# EAGLE schematic picII (EAGLE 9.6.2)
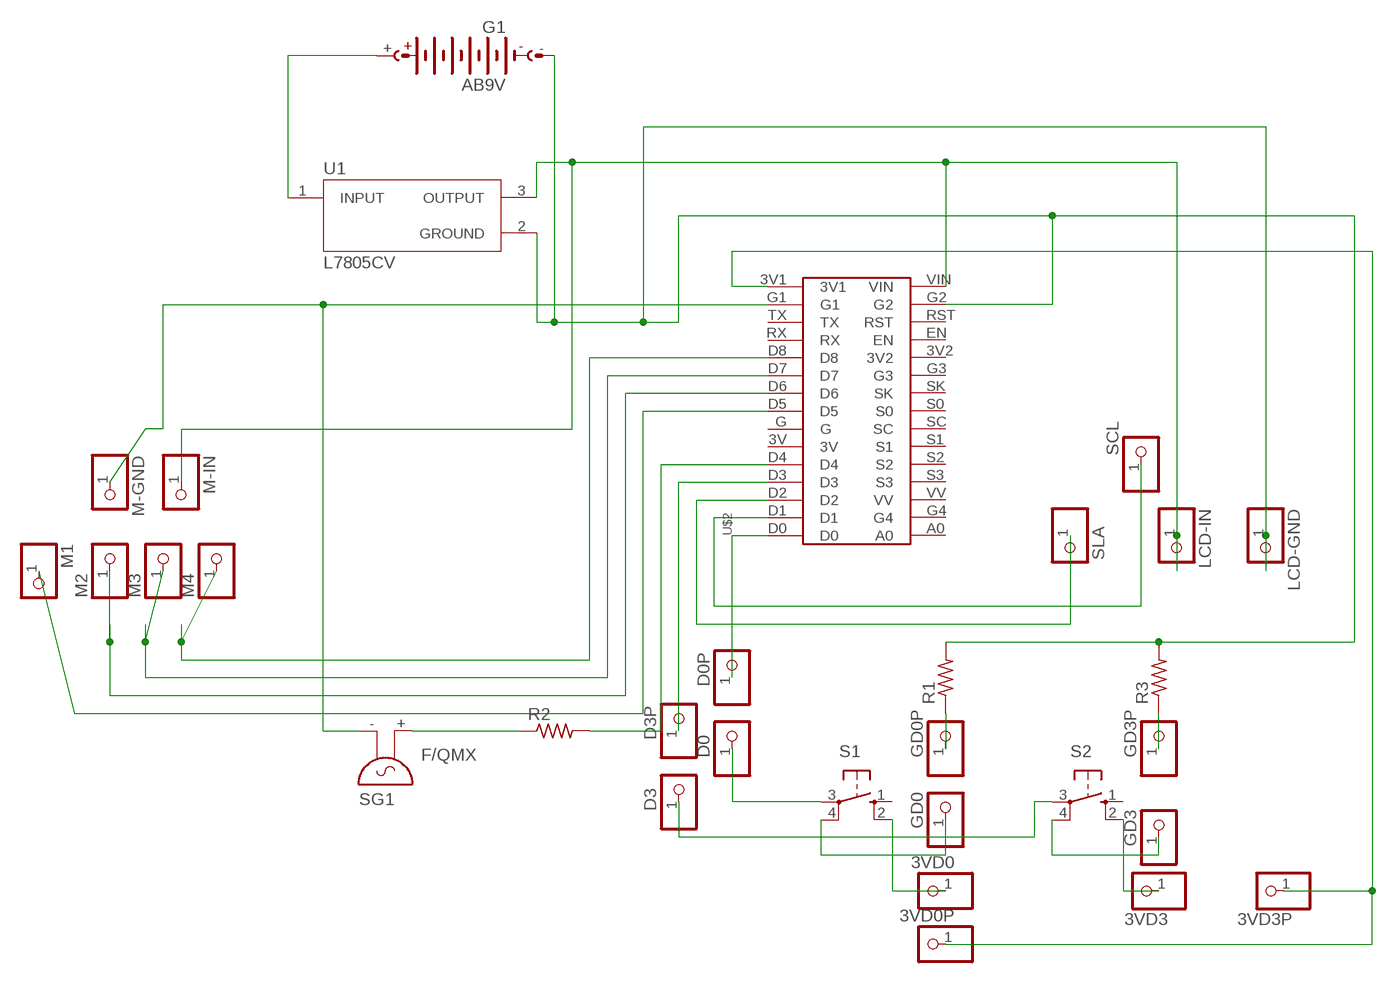
[diagram p0: schematic, sheet 1]

## Parts
3VD0  PINHD-1X1  [1X01]
3VD0P  PINHD-1X1  [1X01]
3VD3  PINHD-1X1  [1X01]
3VD3P  PINHD-1X1  [1X01]
D0  PINHD-1X1  [1X01]
D0P  PINHD-1X1  [1X01]
D3  PINHD-1X1  [1X01]
D3P  PINHD-1X1  [1X01]
G1  AB9V  [AB9V]
GD0  PINHD-1X1  [1X01]
GD0P  PINHD-1X1  [1X01]
GD3  PINHD-1X1  [1X01]
GD3P  PINHD-1X1  [1X01]
LCD-GND  PINHD-1X1  [1X01]
LCD-IN  PINHD-1X1  [1X01]
M1  PINHD-1X1  [1X01]
M2  PINHD-1X1  [1X01]
M3  PINHD-1X1  [1X01]
M4  PINHD-1X1  [1X01]
M-GND  PINHD-1X1  [1X01]
M-IN  PINHD-1X1  [1X01]
R1  R-US_0204/7  [0204/7]
R2  R-US_0204/7  [0204/7]
R3  R-US_0204/7  [0204/7]
S1  40-XX  [B3F-40XX]
S2  40-XX  [B3F-40XX]
SCL  PINHD-1X1  [1X01]
SG1  F/QMX  [F/QMX]
SLA  PINHD-1X1  [1X01]
U1  L7805CV  [TO255P1040X460X1968-3]
U$2  LOLIN  [LOLIN]

## Nets
N$1: G1.+ U1.1(INPUT)
N$2: R2.1 SG1.+
N$3: 3VD0P.1 3VD3P.1 U$2.3V1
N$4: M1.1 U$2.D5
N$5: M2.1 U$2.D6
N$6: R2.2 U$2.D4
N$7: GD0.1 S1.4(P1)
N$8: SLA.1 U$2.D2
N$9: SCL.1 U$2.D1
N$10: M3.1 U$2.D7
N$11: M4.1 U$2.D8
N$12: D0.1 S1.3(P)
N$13: D3.1 S2.3(P)
N$14: M-GND.1 SG1.- U$2.G1
N$15: G1.- LCD-GND.1 R1.2 R3.2 U1.2(GROUND) U$2.G2
N$16: GD3.1 S2.4(P1)
N$17: LCD-IN.1 M-IN.1 U1.3(OUTPUT) U$2.VIN
N$18: GD0P.1 R1.1
N$19: GD3P.1 R3.1
N$20: 3VD0.1 S1.2(S1)
N$21: 3VD3.1 S2.2(S1)
N$22: D0P.1 U$2.D0
N$23: D3P.1 U$2.D3
Unconnected: S1.1(S) S2.1(S) U$2.3V U$2.3V2 U$2.A0 U$2.EN U$2.G U$2.G3 U$2.G4 U$2.RST U$2.RX U$2.S0 U$2.S1 U$2.S2 U$2.S3 U$2.SC U$2.SK U$2.TX U$2.VV

## Library data of the parts
3VD0 3VD0P 3VD3 3VD3P D0 D0P D3 D3P GD0 GD0P GD3 GD3P LCD-GND LCD-IN M1-M4 M-GND M-IN SCL SLA = pinhead:PINHD-1X1: PIN HEADER
G1 = battery:AB9V: 9-V BATTERY CLIP
R1-R3 = rcl:R-US_: RESISTOR, American symbol; SPICEPREFIX: R
S1 S2 = switch-omron:40-XX: OMRON SWITCH; MF: OMRON COMPONENTS USA; MPN: B3F-4000; OC_FARNELL: 176434; OC_NEWARK: 36K3105
SG1 = buzzer:F/QMX: BUZZER Source: Buerklin; OC_FARNELL: unknown; OC_NEWARK: unknown
U1 = L7805CV:L7805CV: Standard Regulator Pos 5V 1.5A 3-Pin(3+Tab) TO-220 Standard Regulator Pos 5V 1.5A 3-Pin(3+Tab) TO-220 Check availability <https://pricing.snapeda.com/parts/L7805CV/STMicroelectronics/view-part?ref=eda>; AVAILABILITY: In Stock; DESCRIPTION: Linear Voltage Regulator IC Positive Fixed 1 Output 1.5A TO-220; MF: STMicroelectronics; MP: L7805CV; PACKAGE: TO-220-3 STMicroelectronics; PRICE: None; PURCHASE-URL: https://pricing.snapeda.com/search?q=L7805CV&ref=eda
U$2 = Lolin:LOLIN

## Module I2C
Ports: SDA(io) SDC(io) IN(io) GND(io)

### Library data of the parts

## Module DRIVERMOTOR
Ports: I1(io) I2(io) I3(io) I4(io) VCC(io) GND(io)

### Library data of the parts